# Altium schematic sheet BCDto7-Bravo.schdoc: BCD to 7-Segment Decoder / Driver
size B; Organization: Altium Limited; Address1: L3, 12a Rodborough Rd; Address2: Frenchs Forest; Address3: NSW; Address4: Australia 2086; DocumentNumber: 1; Revision: Bravo; SheetNumber: 1; SheetTotal: 1
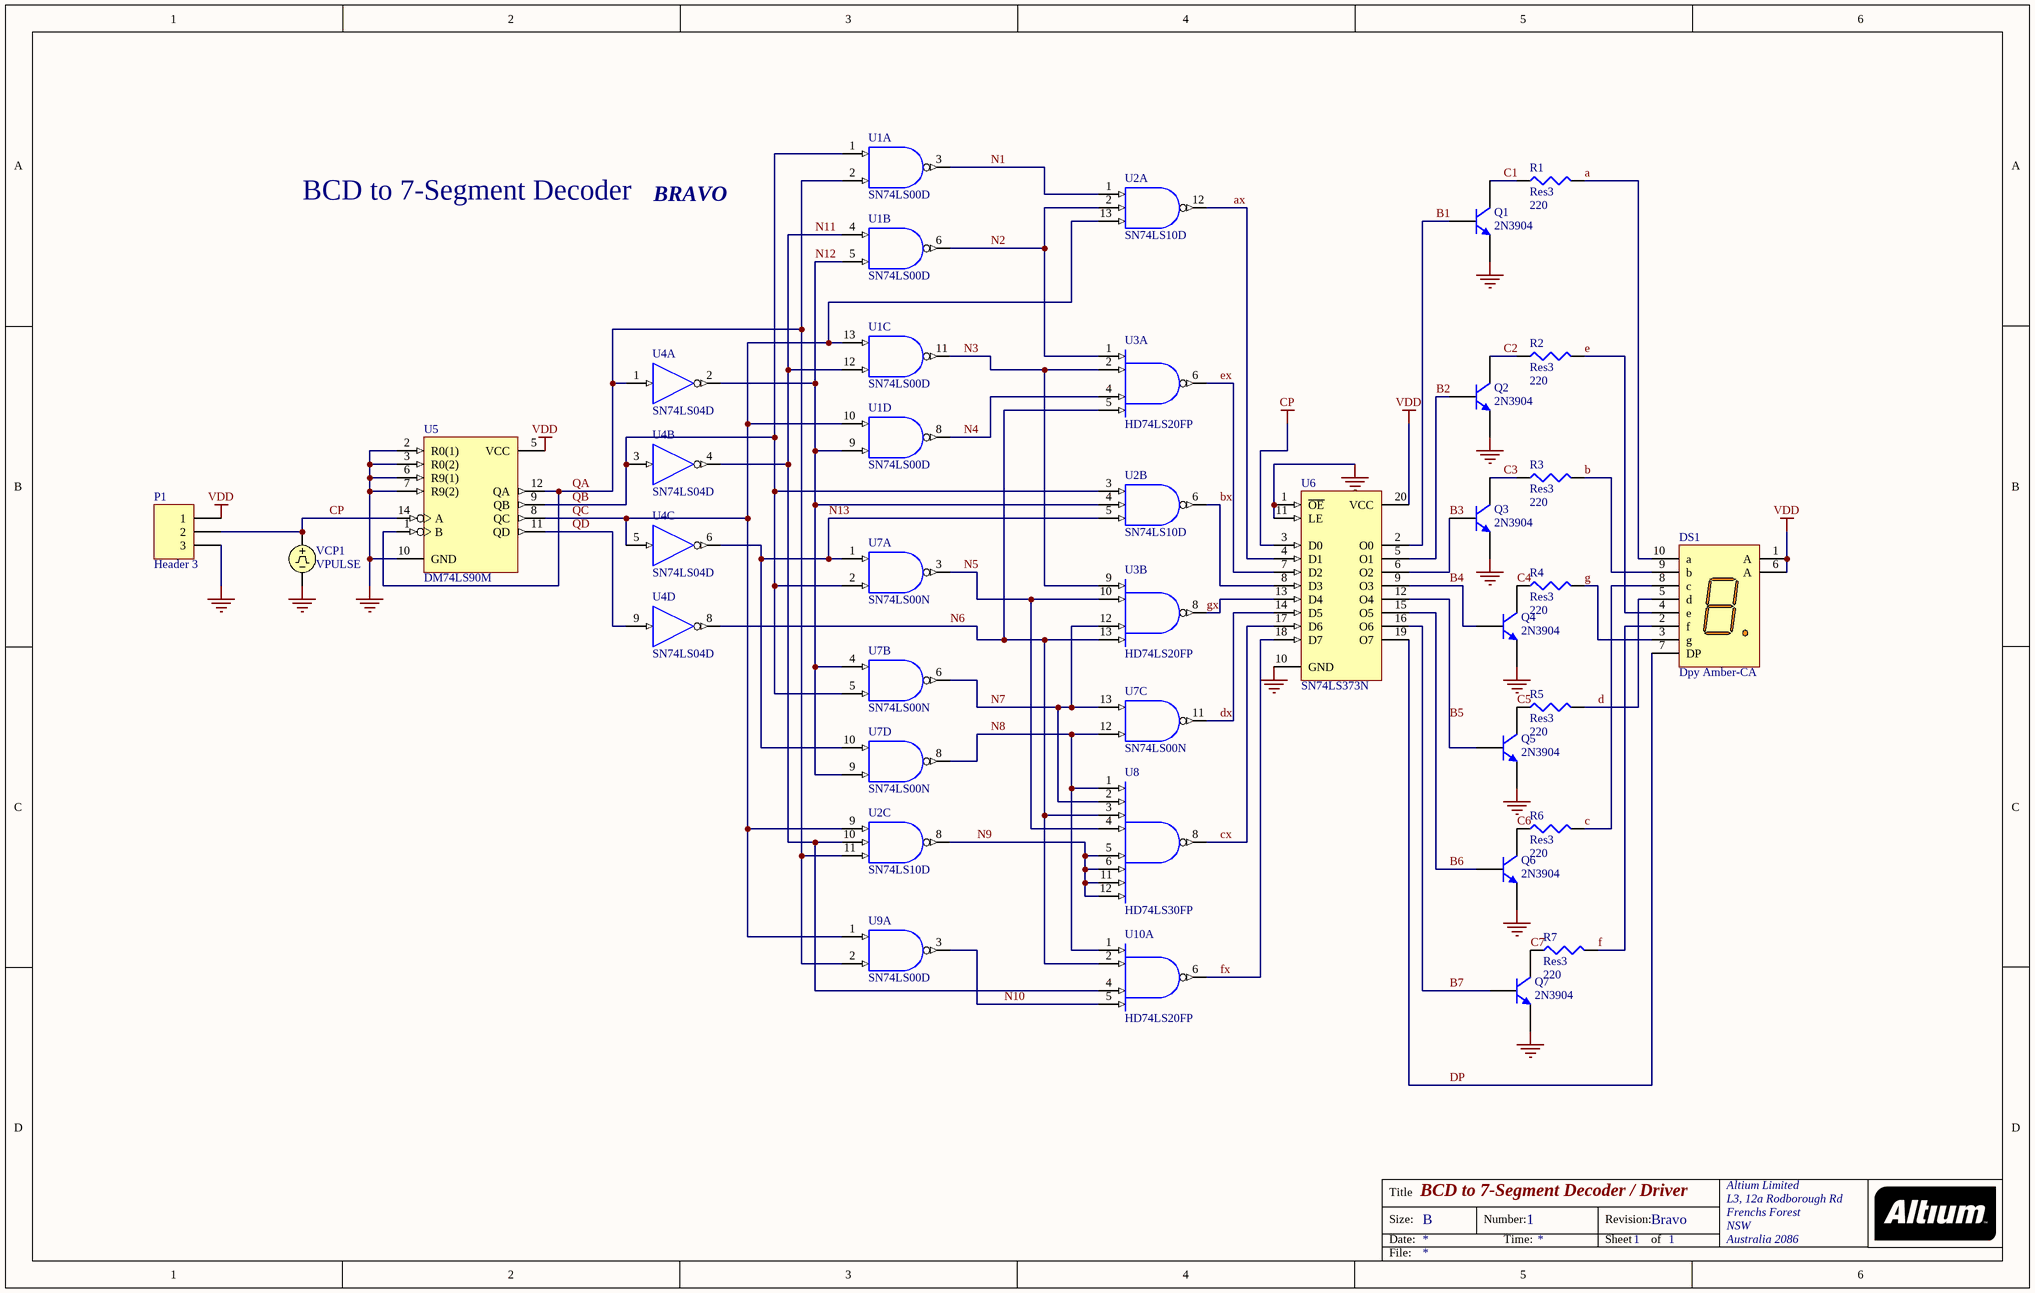
[diagram p0: BCDto7-Bravo.schdoc]

## Parts
DS1  Dpy Amber-CA  [A]
P1  Header 3  [HDR1X3]
Q1  2N3904  [TO-92A]
Q2  2N3904  [TO-92A]
Q3  2N3904  [TO-92A]
Q4  2N3904  [TO-92A]
Q5  2N3904  [TO-92A]
Q6  2N3904  [TO-92A]
Q7  2N3904  [TO-92A]
R1  Res3  value 220  [J1-0603]
R2  Res3  value 220  [J1-0603]
R3  Res3  value 220  [J1-0603]
R4  Res3  value 220  [J1-0603]
R5  Res3  value 220  [J1-0603]
R6  Res3  value 220  [J1-0603]
R7  Res3  value 220  [J1-0603]
U1  SN74LS00D  [751A-03_N]  (parts A,B,C,D of 4)
U2  SN74LS10D  [D014_N]  (parts A,B,C of 3)
U3  HD74LS20FP  [PRSP0014DF-B_N]  (parts A,B of 3)
U4  SN74LS04D  [751A-03_N]  (parts A,B,C,D of 6)
U5  DM74LS90M  [M14A_N]
U6  SN74LS373N  [738-03]
U7  SN74LS00N  [646-06]  (parts A,B,C,D of 4)
U8  HD74LS30FP  [PRSP0014DF-B_N]
U9  SN74LS00D  [751A-03_N]  (part A of 4)
U10  HD74LS20FP  [PRSP0014DF-B_N]  (part A of 3)
VCP1  VPULSE

## Nets
CP: P1.2 U5.14(A) U6.3(D0) VCP1.1
GND: P1.3 Q1.1(E) Q2.1(E) Q3.1(E) Q4.1(E) Q5.1(E) Q6.1(E) Q7.1(E) U1.7(GND) U2.7(GND) U4.7(GND) U5.2(R0(1)) U5.3(R0(2)) U5.6(R9(1)) U5.7(R9(2)) U5.10(GND) U6.1(~{OE}) U6.10(GND) U6.11(LE) U7.7(GND) U9.7(GND) VCP1.2
VCC: U1.14(VCC) U2.14(VCC) U7.14(VCC) U9.14(VCC)
VDD: DS1.1(A) DS1.6(A) P1.1 U4.14(VDD) U5.5(VCC) U6.20(VCC)
a: DS1.10(a) R1.2
ax: U2.12(Y) U6.4(D1)
b: DS1.9(b) R3.2
B1: Q1.2(B) U6.2(O0)
B2: Q2.2(B) U6.5(O1)
B3: Q3.2(B) U6.6(O2)
B4: Q4.2(B) U6.9(O3)
B5: Q5.2(B) U6.12(O4)
B6: Q6.2(B) U6.15(O5)
B7: Q7.2(B) U6.16(O6)
bx: U2.6(Y) U6.8(D3)
c: DS1.8(c) R6.2
C1: Q1.3(C) R1.1
C2: Q2.3(C) R2.1
C3: Q3.3(C) R3.1
C4: Q4.3(C) R4.1
C5: Q5.3(C) R5.1
C6: Q6.3(C) R6.1
C7: Q7.3(C) R7.1
cx: U6.17(D6) U8.8(Y)
d: DS1.5(d) R5.2
DP: DS1.7(DP) U6.19(O7)
dx: U6.14(D5) U7.11(~{O})
e: DS1.4(e) R2.2
ex: U3.6(1Y) U6.7(D2)
f: DS1.2(f) R7.2
fx: U6.18(D7) U10.6(1Y)
g: DS1.3(g) R4.2
gx: U3.8(2Y) U6.13(D4)
N1: U1.3(~{O}) U2.1(A)
N2: U1.6(~{O}) U2.2(B) U3.1(1A)
N3: U1.11(~{O}) U3.2(1B) U3.9(2A)
N4: U1.8(~{O}) U3.4(1C)
N5: U3.10(2B) U7.3(~{O}) U8.4(D)
N6: U3.5(1D) U3.13(2D) U4.8(~{OUT}) U8.3(C) U10.2(1B)
N7: U3.12(2C) U7.6(~{O}) U7.13(A) U8.2(B)
N8: U7.8(~{O}) U7.12(B) U8.1(A) U10.1(1A)
N9: U2.8(Y) U8.5(E) U8.6(F) U8.11(G) U8.12(H)
N10: U9.3(~{O}) U10.5(1D)
N11: U1.4(A) U1.12(B) U2.10(B) U4.4(~{OUT}) U10.4(1C)
N12: U1.5(B) U1.9(B) U2.4(B) U4.2(~{OUT}) U7.4(A) U7.9(B)
N13: U2.5(C) U4.6(~{OUT}) U7.1(A) U7.10(A)
QA: U1.2(B) U2.11(C) U4.1(IN) U5.1(B) U5.12(QA) U9.2(B)
QB: U1.1(A) U2.3(A) U4.3(IN) U5.9(QB) U7.2(B) U7.5(B)
QC: U1.10(A) U1.13(A) U2.9(A) U2.13(C) U4.5(IN) U5.8(QC) U9.1(A)
QD: U4.9(IN) U5.11(QD)

Not connected (* = marked no-connect by the designer): U3 7(GND) 14(VCC); U8 7(GND) 9(NC) 10(NC) 13(NC) 14(VCC); U10 7(GND) 14(VCC)

## Notes on the sheet
- BCD to 7-Segment Decoder
- BRAVO
- Title
- Size:
- Date:
- B
- Number:
- Time:
- Revision:
- Sheet
- of
- File:

## Library data of the parts
DS1 = Dpy Amber-CA: 7.62 mm Black Surface Orange 7-Segment Display: CA, RH DP; MinimumIntensity: 354 ucd; Note: IF = 5 mA; Note: Pins 1 and 6 are redundant Anodes.; Published: 8-Jun-2000; LatestRevisionDate: 17-Dec-2003; LatestRevisionNote: Schematic revised, PCB Footprint replaced.; DatasheetVersion: 19-Feb-2002; PackageVersion: 11-Feb-2002; PackageReference: A; Publisher: Altium Limited; PackageDescription: LED, 7-Segment Display, 7.62 mm, RHD; 10 Leads; Row Space 5.08 mm; Pitch 2.54 mm; Colour: Orange; ComponentLink1Description: Manufacturer Link; ComponentLink1URL: http://www.agilent.com/
P1 = Header 3: Header, 3-Pin; LatestRevisionDate: 17-Jul-2002; LatestRevisionNote: Re-released for DXP Platform.; Publisher: Altium Limited
Q1-Q7 = 2N3904: NPN General Purpose Amplifier; Published: 8-Jun-2000; LatestRevisionDate: 15-Jan-2003; LatestRevisionNote: PCB Footprint 'BCY-W3/D4.7' replaced; DatasheetVersion: 1997; PackageVersion: Sep-1998; PackageReference: TO-92A; Publisher: Altium Limited; PackageDescription: TO, Flat Index; 3 In-Line, Axial Leads; Body Dia. 4.5mm; Leads 0.51 x 0.48 mm (max); ComponentLink1Description: Manufacturer Link; ComponentLink1URL: http://www.fairchildsemi.com/; ComponentLink2Description: Datasheet; ComponentLink2URL: http://www.fairchildsemi.com/ds/2N%2F2N3904.pdf
R1-R7 = Res3: Resistor; Published: 8-Jun-2000; LatestRevisionDate: 29-May-2009; LatestRevisionNote: IPC-7351 Footprint Added.; PackageReference: J1-0603; Publisher: Altium Limited; PackageDescription: Chip Resistor
U1 U9 = SN74LS00D: Quad 2-Input NAND Gate; ComponentAvailability: Not for New Design; Published: 15-Apr-2002; LatestRevisionDate: 13-Apr-2006; LatestRevisionNote: IPC-7351 Footprint Added.; DatasheetVersion: Dec-1999; PackageReference: 751A-03; Publisher: Altium Limited; PackageDescription: 14-Pin Small Outline Integrated Circuit 1.27 mm Pitch; Code_JEDEC: MS-012-AB; Code_IPC: SOIC127P600-14; ComponentLink1Description: Manufacturer Link; ComponentLink1URL: http://www.onsemi.com/; ComponentLink2Description: Datasheet; ComponentLink2URL: http://www.onsemi.com/pub/Collateral/SN74LS00-D.PDF
U2 = SN74LS10D: Triple 3-Input Positive-NAND Gate; Published: 8-Jun-2000; LatestRevisionDate: 13-Apr-2006; LatestRevisionNote: IPC-7351 Footprint Added.; DatasheetVersion: Mar-1988; PackageVersion: Jan-1998; PackageReference: D014; Publisher: Altium Limited; PackageDescription: 14-Pin Small Outline Integrated Circuit 1.27 mm Pitch; Code_IPC: SOIC127P600-14; ComponentLink1Description: Manufacturer Link; ComponentLink1URL: http://www.ti.com/; ComponentLink2Description: Datasheet; ComponentLink2URL: http://www-s.ti.com/sc/ds/sn74ls10.pdf
U3 U10 = HD74LS20FP: Dual 4-Input NAND Gates; Published: 10-Feb-2010; DatasheetVersion: Rev.2.00, Feb-2005; PackageVersion: Sep-2005; PackageReference: PRSP0014DF-B; Publisher: Altium Limited; PackageDescription: 14-Pin Plastic Small Outline Package, 10.06 x 5.5 mm Body, 1.27 mm Pitch; Code_JEITA: P-SOP14-5.5x10.06-1.27; ComponentLink1Description: Manufacturer Link; ComponentLink1URL: http://sg.renesas.com/fmwk.jsp?cnt=hd74ls_root.jsp&fp=/products/standard_ic/general_purpose_logic/5v_standard_logic/hd74ls/; ComponentLink2Description: Datasheet; ComponentLink2URL: http://documentation.renesas.com/eng/products/logic/rej03d0400_hd74ls20.pdf; ComponentLink3Description: Packaging Specification; ComponentLink3URL: http://sg.renesas.com/media/products/common_info/package/pdf/ic/code/prsp0014df_b.pdf
U4 = SN74LS04D: Hex Inverter; Published: 15-Apr-2002; LatestRevisionDate: 13-Apr-2006; LatestRevisionNote: IPC-7351 Footprint Added.; DatasheetVersion: 1999; PackageReference: 751A-03; Publisher: Altium Limited; PackageDescription: 14-Pin Small Outline Integrated Circuit 1.27 mm Pitch; Code_JEDEC: MS-012-AB; Code_IPC: SOIC127P600-14; ComponentLink1Description: Manufacturer Link; ComponentLink1URL: http://www.onsemi.com/; ComponentLink2Description: Datasheet; ComponentLink2URL: http://www.onsemi.com/pub/Collateral/SN74LS04-D.PDF
U5 = DM74LS90M: Decade and Binary Counter; Note: NC pins 4 and 13 are not drawn.; Published: 17-Jul-2002; LatestRevisionDate: 13-Apr-2006; LatestRevisionNote: IPC-7351 Footprint Added.; DatasheetVersion: Mar-1998; PackageVersion: 2000; PackageReference: M14A; Publisher: Altium Limited; PackageDescription: 14-Pin Small Outline Integrated Circuit 1.27 mm Pitch; Code_IPC: SOIC127P600-14; ComponentLink1Description: Manufacturer Link; ComponentLink1URL: http://www.fairchildsemi.com/
U6 = SN74LS373N: Octal Transparent Latch with 3-State Outputs; Published: 15-Apr-2002; DatasheetVersion: Dec-1999; PackageVersion: 1996; PackageReference: 738-03; Publisher: Altium Limited; PackageDescription: DIP; 20 Leads; Row Spacing 7.62 mm; Pitch 2.54 mm; Code_JEDEC: MS-001-AD; ComponentLink1Description: Manufacturer Link; ComponentLink1URL: http://www.onsemi.com/; ComponentLink2Description: Datasheet; ComponentLink2URL: http://www.onsemi.com/pub/Collateral/SN74LS373-D.PDF
U7 = SN74LS00N: Quad 2-Input NAND Gate; ComponentAvailability: Not for New Design; Published: 15-Apr-2002; DatasheetVersion: Dec-1999; PackageVersion: 1995; PackageReference: 646-06; Publisher: Altium Limited; PackageDescription: DIP; 14 Leads; Row Spacing 7.62 mm; Pitch 2.54 mm; ComponentLink1Description: Manufacturer Link; ComponentLink1URL: http://www.onsemi.com/; ComponentLink2Description: Datasheet; ComponentLink2URL: http://www.onsemi.com/pub/Collateral/SN74LS00-D.PDF
U8 = HD74LS30FP: 8-Input NAND Gate; Published: 10-Feb-2010; DatasheetVersion: Rev.2.00, Feb-2005; PackageVersion: Sep-2005; PackageReference: PRSP0014DF-B; Publisher: Altium Limited; PackageDescription: 14-Pin Plastic Small Outline Package, 10.06 x 5.5 mm Body, 1.27 mm Pitch; Code_JEITA: P-SOP14-5.5x10.06-1.27; ComponentLink1Description: Manufacturer Link; ComponentLink1URL: http://sg.renesas.com/fmwk.jsp?cnt=hd74ls_root.jsp&fp=/products/standard_ic/general_purpose_logic/5v_standard_logic/hd74ls/; ComponentLink2Description: Datasheet; ComponentLink2URL: http://documentation.renesas.com/eng/products/logic/rej03d0404_hd74ls30.pdf; ComponentLink3Description: Packaging Specification; ComponentLink3URL: http://sg.renesas.com/media/products/common_info/package/pdf/ic/code/prsp0014df_b.pdf
VCP1 = VPULSE: Pulse Voltage Source